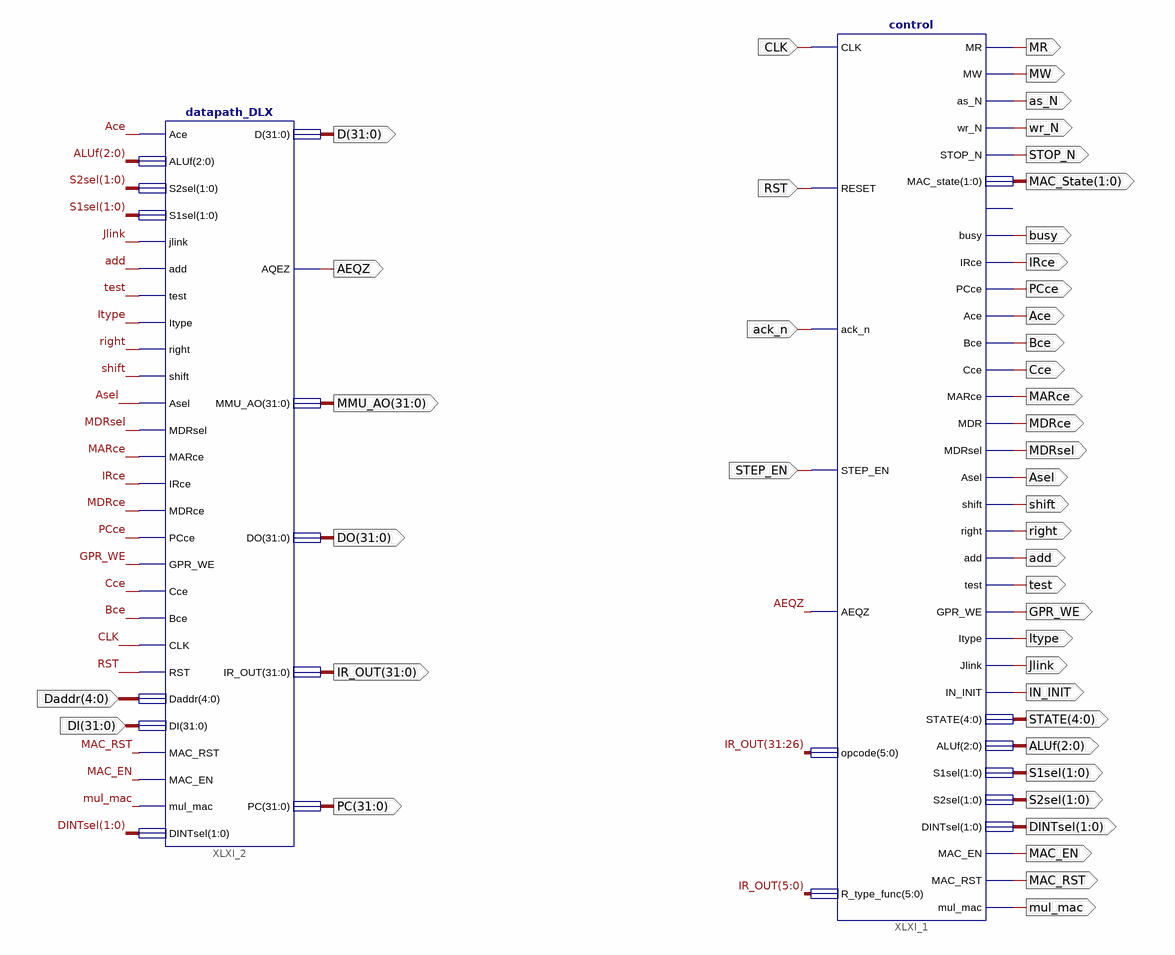
[diagram p0: schematic sheet 1]
// Xilinx ISE schematic DLX_toplevel.sch (spartan6) as structural Verilog: 2 symbols, 44 ports
module DLX_toplevel (
  input  CLK,
  input  RST,
  input  ack_n,
  input  STEP_EN,
  input  [4:0] Daddr,
  input  [31:0] DI,
  output Jlink,
  output Itype,
  output GPR_WE,
  output test,
  output add,
  output right,
  output shift,
  output Asel,
  output MDRsel,
  output MDRce,
  output MARce,
  output Cce,
  output Bce,
  output Ace,
  output PCce,
  output IRce,
  output [1:0] S1sel,
  output [2:0] ALUf,
  output [1:0] S2sel,
  output AEQZ,
  output MW,
  output MR,
  output as_N,
  output wr_N,
  output STOP_N,
  output [1:0] MAC_State,
  output busy,
  output IN_INIT,
  output [4:0] STATE,
  output [1:0] DINTsel,
  output MAC_EN,
  output MAC_RST,
  output mul_mac,
  output [31:0] D,
  output [31:0] MMU_AO,
  output [31:0] DO,
  output [31:0] IR_OUT,
  output [31:0] PC
);

  control XLXI_1 (
    .CLK(CLK), .RESET(RST), .ack_n(ack_n), .STEP_EN(STEP_EN), .AEQZ(AEQZ), .opcode(IR_OUT[31:26]),
    .R_type_func(IR_OUT[5:0]), .MR(MR), .MW(MW), .as_N(as_N), .wr_N(wr_N), .STOP_N(STOP_N),
    .MAC_state(MAC_State), .busy(busy), .IRce(IRce), .PCce(PCce), .Ace(Ace), .Bce(Bce), .Cce(Cce),
    .MARce(MARce), .MDR(MDRce), .MDRsel(MDRsel), .Asel(Asel), .shift(shift), .right(right), .add(add),
    .test(test), .GPR_WE(GPR_WE), .Itype(Itype), .Jlink(Jlink), .IN_INIT(IN_INIT), .STATE(STATE),
    .ALUf(ALUf), .S1sel(S1sel), .S2sel(S2sel), .DINTsel(DINTsel), .MAC_EN(MAC_EN), .MAC_RST(MAC_RST),
    .mul_mac(mul_mac));  // open: busy_m
  datapath_DLX XLXI_2 (
    .Ace(Ace), .ALUf(ALUf), .S2sel(S2sel), .S1sel(S1sel), .jlink(Jlink), .add(add), .test(test),
    .Itype(Itype), .right(right), .shift(shift), .Asel(Asel), .MDRsel(MDRsel), .MARce(MARce), .IRce(IRce),
    .MDRce(MDRce), .PCce(PCce), .GPR_WE(GPR_WE), .Cce(Cce), .Bce(Bce), .CLK(CLK), .RST(RST), .Daddr(Daddr),
    .DI(DI), .MAC_RST(MAC_RST), .MAC_EN(MAC_EN), .mul_mac(mul_mac), .DINTsel(DINTsel), .D(D), .AQEZ(AEQZ),
    .MMU_AO(MMU_AO), .DO(DO), .IR_OUT(IR_OUT), .PC(PC));
endmodule
